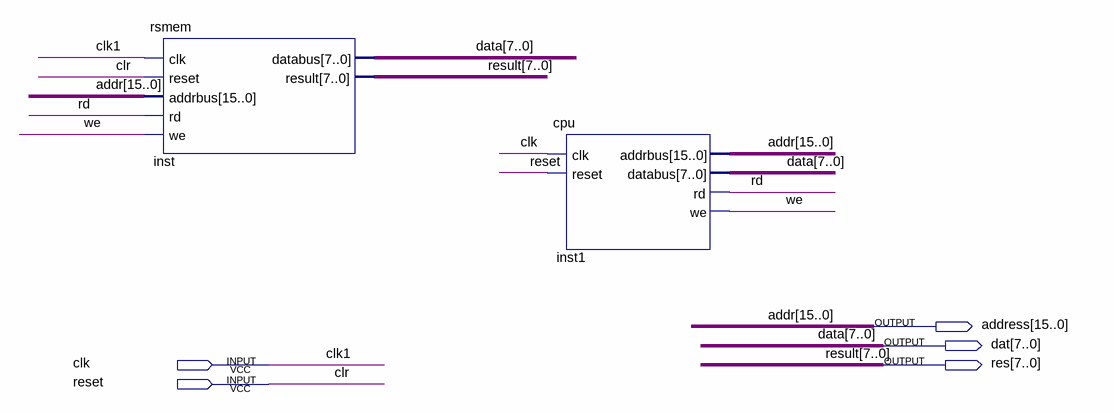
[diagram p0: schematic sheet]
// Quartus schematic rxycpu.bdf as structural Verilog: 2 symbols, 5 pins
module rxycpu (
  input  clk,
  input  reset,
  output [15:0] address,
  output [7:0] dat,
  output [7:0] res
);

  wire rd, we;

  rsmem inst (.clk(clk), .reset(reset), .addrbus(address), .rd(rd), .we(we), .result(res), .databus(dat));
  cpu inst1 (.clk(clk), .reset(reset), .addrbus(address), .rd(rd), .we(we), .databus(dat));

  // Other names for the same wires on the sheet: addr[15:0] = address; clk1 = clk; clr = reset; data[7:0] = dat;
  //   result[7:0] = res
endmodule
